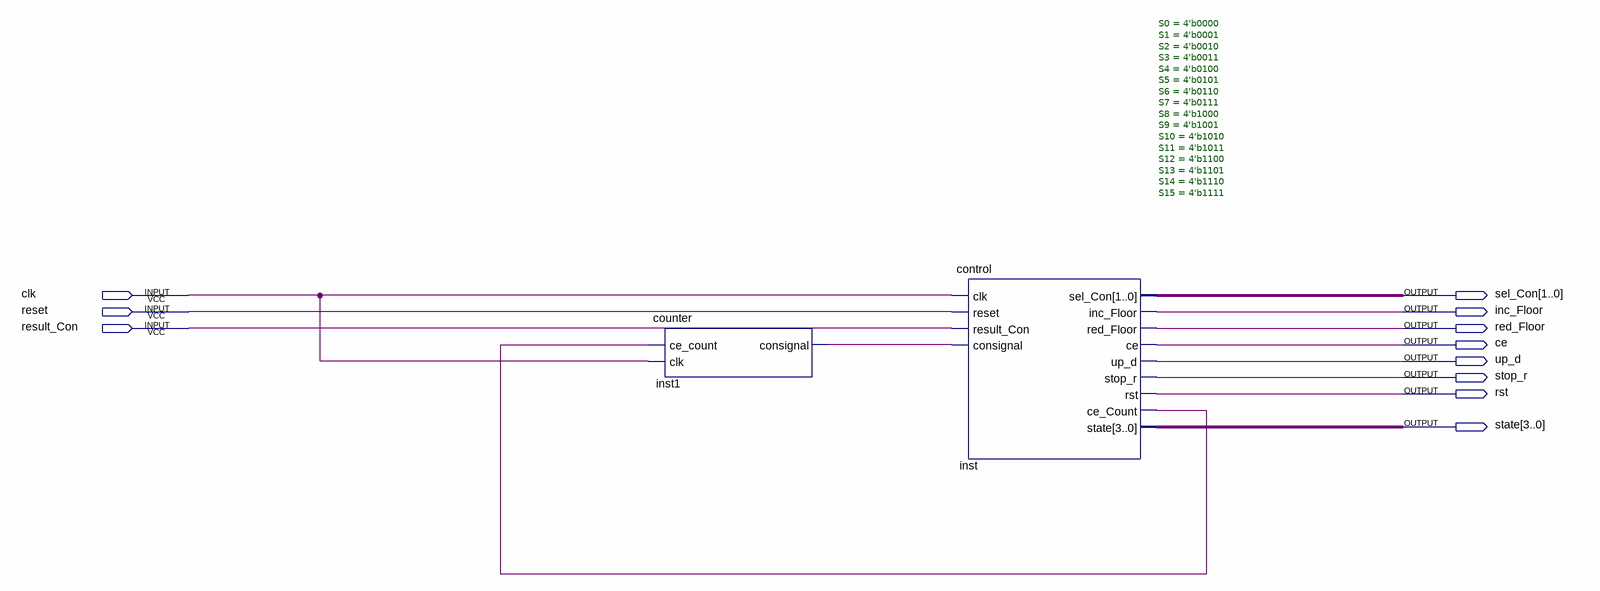
[diagram p0: schematic sheet]
// Quartus schematic controlltst.bdf as structural Verilog: 2 symbols, 11 pins
module controlltst (
  input  clk,
  input  reset,
  input  result_Con,
  output [1:0] sel_Con,
  output inc_Floor,
  output red_Floor,
  output ce,
  output up_d,
  output stop_r,
  output rst,
  output [3:0] state
);

  wire inst1_consignal, inst_ce_count;

  counter inst1 (.ce_count(inst_ce_count), .clk(clk), .consignal(inst1_consignal));
  control #(.S0(4'b0000), .S1(4'b0001), .S2(4'b0010), .S3(4'b0011), .S4(4'b0100), .S5(4'b0101), .S6(4'b0110), .S7(4'b0111), .S8(4'b1000), .S9(4'b1001), .S10(4'b1010), .S11(4'b1011), .S12(4'b1100), .S13(4'b1101), .S14(4'b1110), .S15(4'b1111)) inst (
    .clk(clk), .reset(reset), .result_Con(result_Con), .consignal(inst1_consignal), .sel_Con(sel_Con),
    .inc_Floor(inc_Floor), .red_Floor(red_Floor), .ce(ce), .up_d(up_d), .stop_r(stop_r), .rst(rst),
    .ce_Count(inst_ce_count), .state(state));
endmodule
